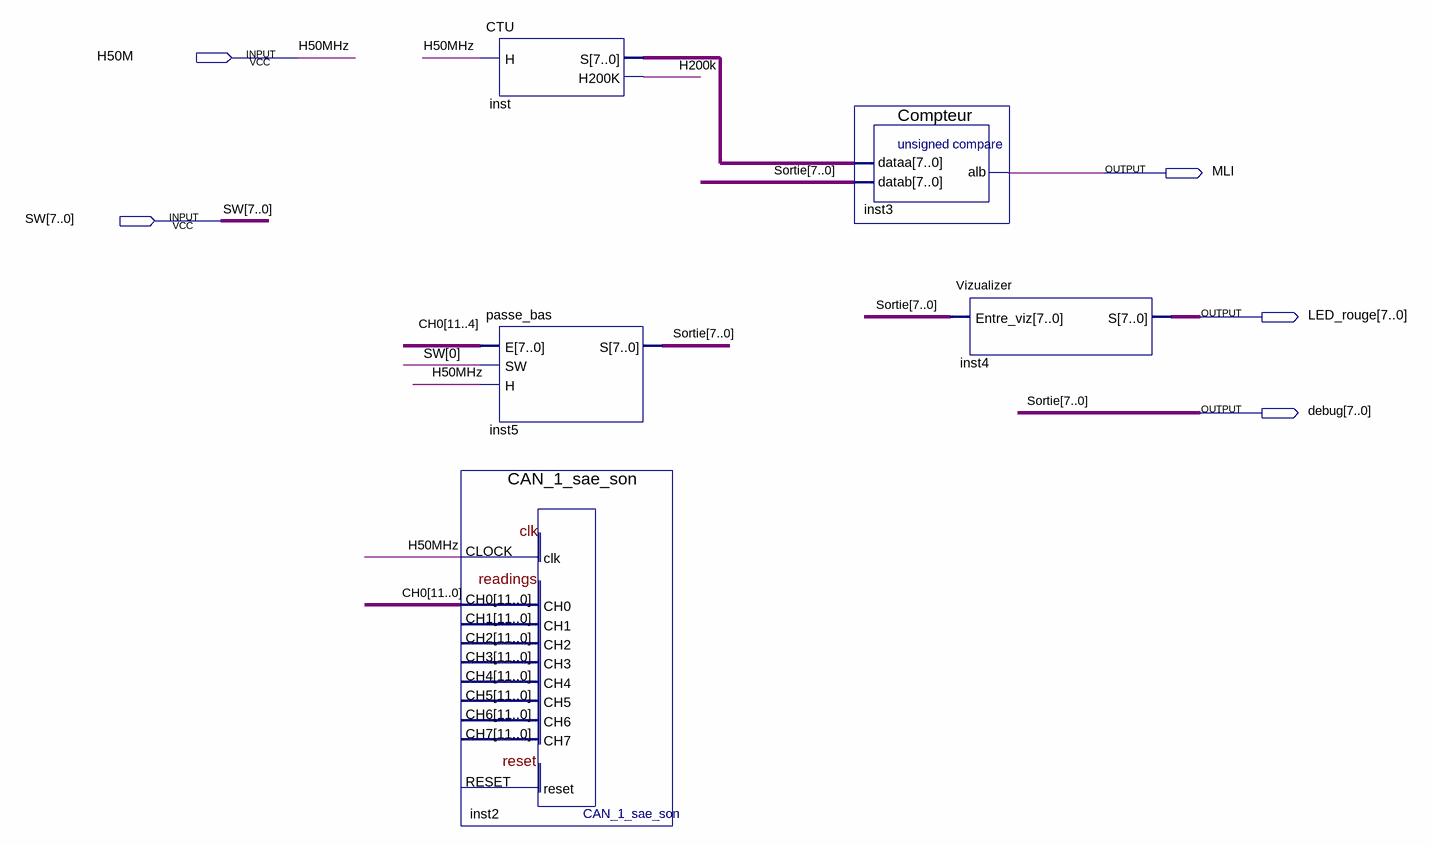
[diagram p0: schematic sheet]
// Quartus schematic TOP.bdf as structural Verilog: 5 symbols, 5 pins
module TOP (
  input  H50M,
  input  [7:0] SW,
  output MLI,
  output [7:0] LED_rouge,
  output [7:0] debug
);

  wire H200k;
  wire [7:0] inst_s;
  wire [11:0] CH0;

  CTU inst (.H(H50M), .S(inst_s), .H200K(H200k));
  passe_bas inst5 (.E(CH0[11:4]), .SW(SW[0]), .H(H50M), .S(debug));
  CAN_1_sae_son inst2 (.CLOCK(H50M), .CH0(CH0));  // open: RESET, CH1, CH2, CH3, CH4, CH5, CH6, CH7
  Compteur inst3 (.dataa(inst_s), .datab(debug), .alb(MLI));
  Vizualizer inst4 (.Entre_viz(debug), .S(LED_rouge));

  // Other names for the same wires on the sheet: H50MHz = H50M; Sortie[7:0] = debug
endmodule
